# EAGLE design dac (EAGLE 9.3.0)
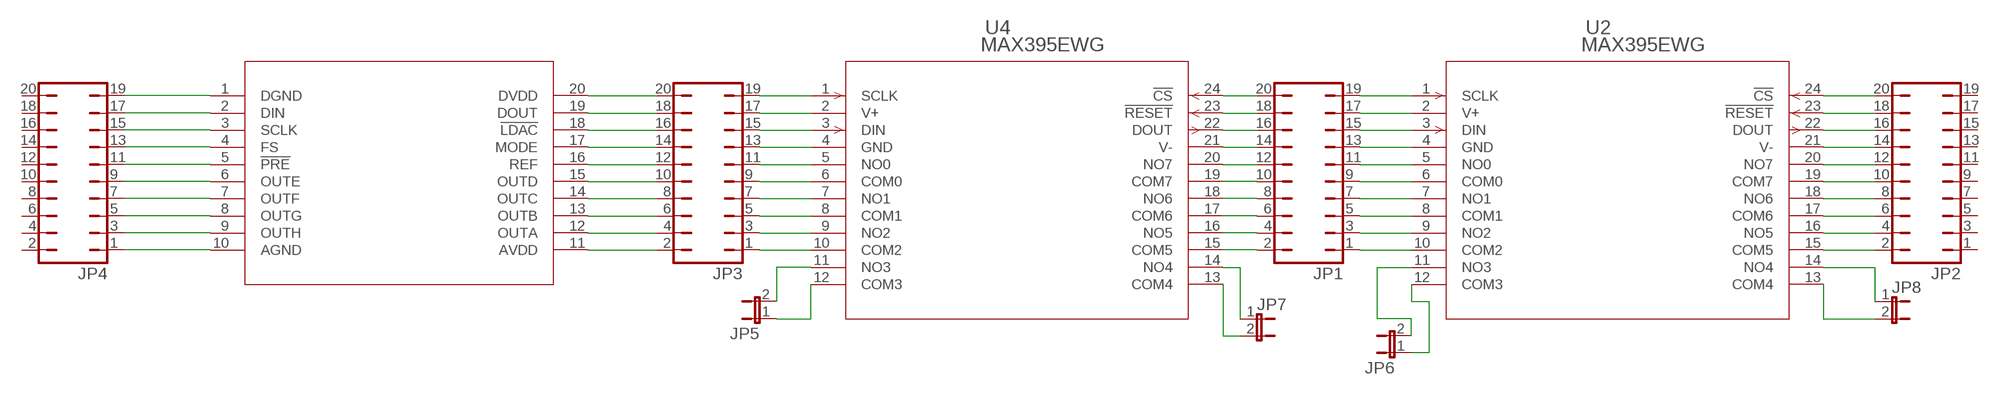
[diagram p0: schematic, sheet 1]

## Parts
JP1  JP10Q  [JP10Q]
JP2  JP10Q  [JP10Q]
JP3  JP10Q  [JP10Q]
JP4  JP10Q  [JP10Q]
JP5  JP1E  [JP1]
JP6  JP1E  [JP1]
JP7  JP1E  [JP1]
JP8  JP1E  [JP1]
U1  TLV5610_DW_20  [DW20]
U2  MAX395EWG  [21-0042B_24]
U4  MAX395EWG  [21-0042B_24]

## Nets
N$1: JP3.19 U4.1(SCLK)
N$2: JP3.17 U4.2(V+)
N$3: JP3.15 U4.3(DIN)
N$4: JP3.13 U4.4(GND)
N$5: JP3.11 U4.5(NO0)
N$6: JP3.9 U4.6(COM0)
N$7: JP3.7 U4.7(NO1)
N$8: JP3.5 U4.8(COM1)
N$9: JP3.3 U4.9(NO2)
N$10: JP3.1 U4.10(COM2)
N$11: JP1.20 U4.24(!CS)
N$12: JP1.18 U4.23(!RESET)
N$13: JP1.16 U4.22(DOUT)
N$14: JP1.14 U4.21(V-)
N$15: JP1.12 U4.20(NO7)
N$16: JP1.10 U4.19(COM7)
N$17: JP1.8 U4.18(NO6)
N$18: JP1.6 U4.17(COM6)
N$19: JP1.4 U4.16(NO5)
N$20: JP1.2 U4.15(COM5)
N$21: JP3.20 U1.20(DVDD)
N$22: JP3.18 U1.19(DOUT)
N$23: JP3.16 U1.18(!LDAC)
N$24: JP3.14 U1.17(MODE)
N$25: JP3.12 U1.16(REF)
N$26: JP3.10 U1.15(OUTD)
N$27: JP3.8 U1.14(OUTC)
N$28: JP3.6 U1.13(OUTB)
N$29: JP3.4 U1.12(OUTA)
N$30: JP3.2 U1.11(AVDD)
N$31: JP4.1 U1.10(AGND)
N$32: JP4.3 U1.9(OUTH)
N$33: JP4.5 U1.8(OUTG)
N$34: JP4.7 U1.7(OUTF)
N$35: JP4.9 U1.6(OUTE)
N$36: JP4.11 U1.5(!PRE)
N$37: JP4.13 U1.4(FS)
N$38: JP4.15 U1.3(SCLK)
N$39: JP4.17 U1.2(DIN)
N$40: JP4.19 U1.1(DGND)
N$41: JP1.19 U2.1(SCLK)
N$42: JP1.17 U2.2(V+)
N$43: JP1.15 U2.3(DIN)
N$44: JP1.13 U2.4(GND)
N$45: JP1.11 U2.5(NO0)
N$46: JP1.9 U2.6(COM0)
N$47: JP1.7 U2.7(NO1)
N$48: JP1.5 U2.8(COM1)
N$49: JP1.3 U2.9(NO2)
N$50: JP1.1 U2.10(COM2)
N$51: JP2.20 U2.24(!CS)
N$52: JP2.18 U2.23(!RESET)
N$53: JP2.16 U2.22(DOUT)
N$54: JP2.14 U2.21(V-)
N$55: JP2.12 U2.20(NO7)
N$56: JP2.10 U2.19(COM7)
N$57: JP2.8 U2.18(NO6)
N$58: JP2.6 U2.17(COM6)
N$59: JP2.4 U2.16(NO5)
N$60: JP2.2 U2.15(COM5)
N$61: JP5.2 U4.11(NO3)
N$62: JP5.1 U4.12(COM3)
N$63: JP7.1 U4.14(NO4)
N$64: JP7.2 U4.13(COM4)
N$65: JP6.2 U2.11(NO3)
N$66: JP6.1 U2.12(COM3)
N$67: JP8.1 U2.14(NO4)
N$68: JP8.2 U2.13(COM4)
Unconnected: JP2.1 JP2.3 JP2.5 JP2.7 JP2.9 JP2.11 JP2.13 JP2.15 JP2.17 JP2.19 JP4.2 JP4.4 JP4.6 JP4.8 JP4.10 JP4.12 JP4.14 JP4.16 JP4.18 JP4.20

## Library data of the parts
JP1-JP4 = jumper:JP10Q: JUMPER
JP5-JP8 = jumper:JP1E: JUMPER
U1 = tlv5610a:TLV5610_DW_20; MANUFACTURER_PART_NUMBER: TLV5610_DW_20; VENDOR: Texas Instruments
U2 U4 = max395:MAX395EWG; MANUFACTURER_PART_NUMBER: max395ewg; VENDOR: Maxim Integrated Products

## Net classes
1 power: width 0.254 mm

## Board
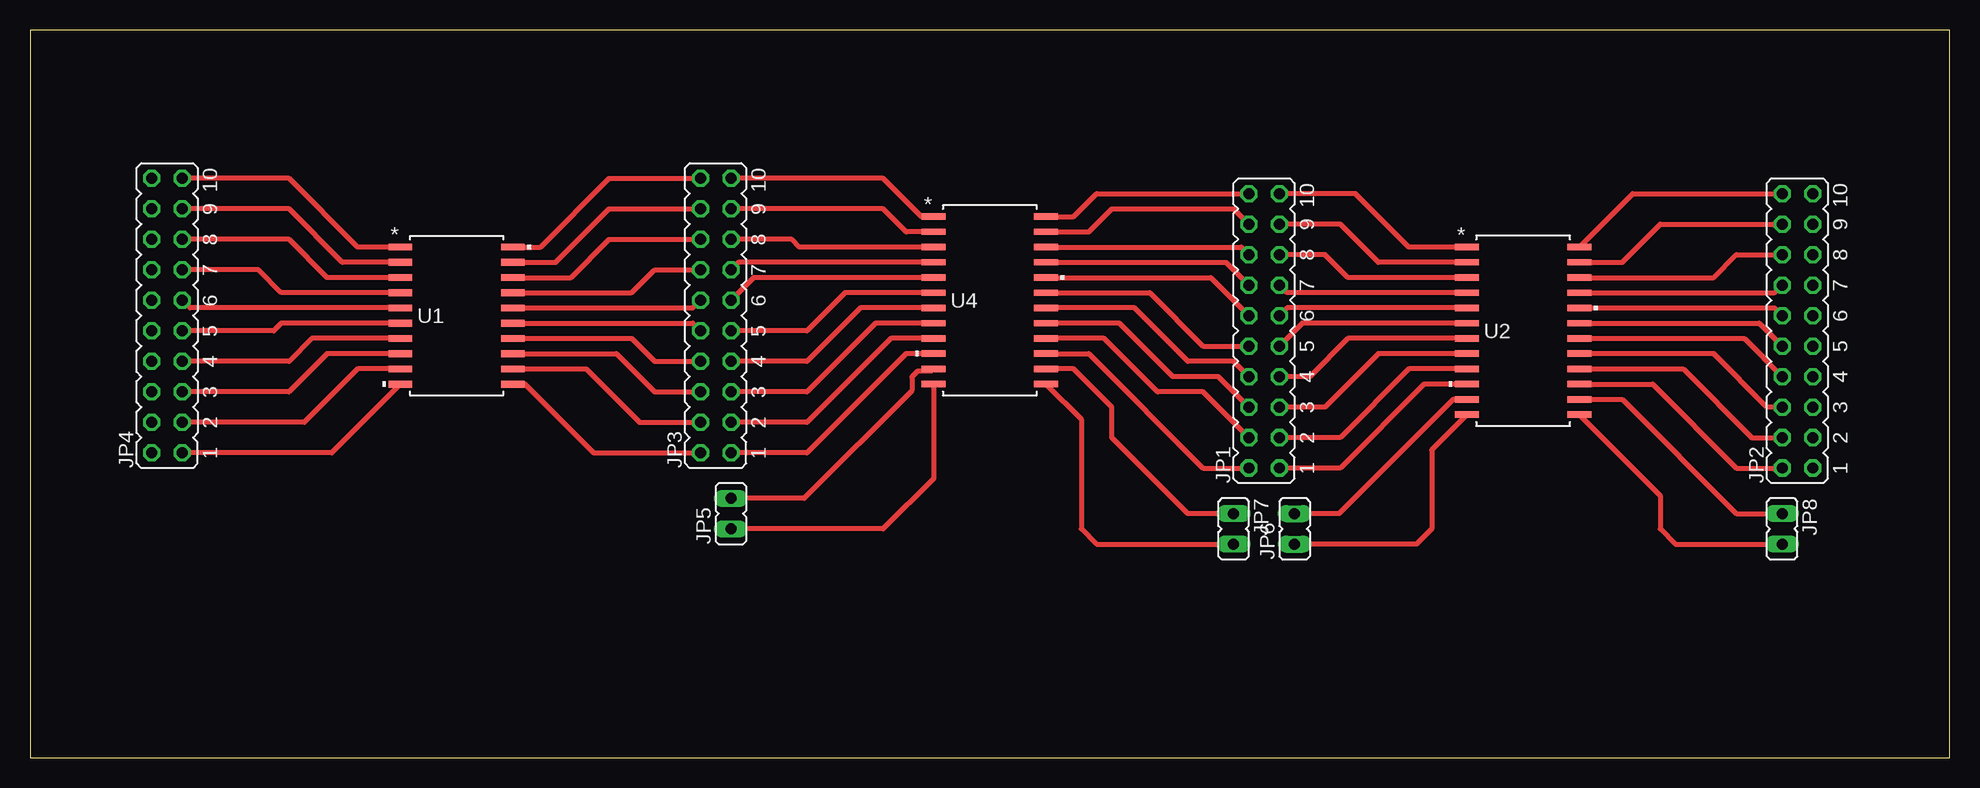
[diagram p1: board, top side]

Size 160 x 60.63 mm. Coordinates in mm from the lower left corner, seen from the top.
Outline: 0,0 160,0 160,60.63 0,60.63 0,0
Copper layers (1*16): Top 0.035mm / dielectric 1.5mm / Bottom 0.035mm
Design rules "default *": minimum track width 6mil, minimum drill 0.35mm, track to track 24mil, track to pad 24mil, pad to pad 24mil, via to via 24mil, smd to smd 24mil, copper to edge 40mil, drill to drill 6mil, minimum pad ring 10mil, minimum via ring 8mil, stop-mask expansion 4mil, vias tented up to drill 0mil, thermal gap 10mil

### Footprints (pad centres in the part's own frame; a part is rotated, then mirrored left to right if it is on the bottom)
JP10Q = drill 0.914 octagon: 1 -11.43,-1.27; 2 -11.43,1.27; 3 -8.89,-1.27; 4 -8.89,1.27; 5 -6.35,-1.27; 6 -6.35,1.27; 7 -3.81,-1.27; 8 -3.81,1.27; 9 -1.27,-1.27; 10 -1.27,1.27; 11 1.27,-1.27; 12 1.27,1.27; 13 3.81,-1.27; 14 3.81,1.27; 15 6.35,-1.27; 16 6.35,1.27; 17 8.89,-1.27; 18 8.89,1.27; 19 11.43,-1.27; 20 11.43,1.27
JP1 = drill 0.914 long: 1 0,-1.27; 2 0,1.27
DW20 = smd 1.981 x 0.559: 1 -4.686,5.715; 2 -4.686,4.445; 3 -4.686,3.175; 4 -4.686,1.905; 5 -4.686,0.635; 6 -4.686,-0.635; 7 -4.686,-1.905; 8 -4.686,-3.175; 9 -4.686,-4.445; 10 -4.686,-5.715; 11 4.686,-5.715; 12 4.686,-4.445; 13 4.686,-3.175; 14 4.686,-1.905; 15 4.686,-0.635; 16 4.686,0.635; 17 4.686,1.905; 18 4.686,3.175; 19 4.686,4.445; 20 4.686,5.715
21-0042B_24 = smd 1.981 x 0.533: 1 -4.686,6.985; 2 -4.686,5.715; 3 -4.686,4.445; 4 -4.686,3.175; 5 -4.686,1.905; 6 -4.686,0.635; 7 -4.686,-0.635; 8 -4.686,-1.905; 9 -4.686,-3.175; 10 -4.686,-4.445; 11 -4.686,-5.715; 12 -4.686,-6.985; 13 4.686,-6.985; 14 4.686,-5.715; 15 4.686,-4.445; 16 4.686,-3.175; 17 4.686,-1.905; 18 4.686,-0.635; 19 4.686,0.635; 20 4.686,1.905; 21 4.686,3.175; 22 4.686,4.445; 23 4.686,5.715; 24 4.686,6.985

### Placement (x,y rotation side)
JP1  102.87,35.56 90 top
JP2  147.32,35.56 90 top
JP3  57.15,36.83 90 top
JP4  11.43,36.83 90 top
JP5  58.42,20.32 0 top
JP6  105.41,19.05 0 top
JP7  100.33,19.05 180 top
JP8  146.05,19.05 180 top
U1  35.56,36.83 0 top
U2  124.46,35.56 0 top
U4  80.01,38.1 0 top

### Tracks (layer width: path | path; a pad name or v marks a point on that pad's centre or on a via)
N$1
  Top 0.406: U4.1 74.3,45.09 71.12,48.26 JP3.19
N$2
  Top 0.406: U4.2 73.03,43.81 71.12,45.72 JP3.17
N$3
  Top 0.406: U4.3 64.14,42.55 63.5,43.18 JP3.15
N$4
  Top 0.406: U4.4 59.05,41.27 JP3.13
N$5
  Top 0.406: U4.5 60.33,40.01 JP3.11
N$6
  Top 0.406: U4.6 67.94,38.73 64.77,35.56 JP3.9
N$7
  Top 0.406: U4.7 69.22,37.47 64.77,33.02 JP3.7
N$8
  Top 0.406: U4.8 70.48,36.2 64.77,30.48 JP3.5
N$9
  Top 0.406: U4.9 71.75,34.92 64.77,27.94 JP3.3
N$10
  Top 0.406: U4.10 73.03,33.66 64.77,25.4 JP3.1
N$11
  Top 0.406: U4.24 87,45.09 88.9,46.99 JP1.20
N$12
  Top 0.406: U4.23 88.27,43.81 90.17,45.72 100.33,45.72 JP1.18
N$13
  Top 0.406: U4.22 100.97,42.55 JP1.16
N$14
  Top 0.406: U4.21 99.69,41.27 JP1.14
N$15
  Top 0.406: U4.20 98.42,40.01 JP1.12
N$16
  Top 0.406: U4.19 93.34,38.73 97.79,34.29 JP1.10
N$17
  Top 0.406: JP1.8 100.33,33.02 96.52,33.02 92.08,37.47 U4.18
N$18
  Top 0.406: JP1.6 99.06,31.75 95.25,31.75 90.81,36.2 U4.17
N$19
  Top 0.406: JP1.4 97.79,30.48 93.98,30.48 89.53,34.92 U4.16
N$20
  Top 0.406: U4.15 88.27,33.66 97.79,24.13 JP1.2
N$21
  Top 0.406: U1.20 42.55,42.55 48.26,48.26 JP3.20
N$22
  Top 0.406: U1.19 43.81,41.27 48.26,45.72 JP3.18
N$23
  Top 0.406: U1.18 45.09,40.01 48.26,43.18 JP3.16
N$24
  Top 0.406: U1.17 50.16,38.73 52.07,40.64 JP3.14
N$25
  Top 0.406: U1.16 55.24,37.47 JP3.12
N$26
  Top 0.406: U1.15 55.24,36.2 JP3.10
N$27
  Top 0.406: U1.14 50.16,34.92 52.07,33.02 JP3.8
N$28
  Top 0.406: U1.13 48.9,33.66 52.07,30.48 JP3.6
N$29
  Top 0.406: U1.12 46.35,32.38 50.8,27.94 JP3.4
N$30
  Top 0.406: U1.11 41.27,31.11 46.99,25.4 JP3.2
N$31
  Top 0.406: U1.10 25.16,25.4 JP4.1
N$32
  Top 0.406: U1.9 27.3,32.38 22.86,27.94 JP4.3
N$33
  Top 0.406: U1.8 24.77,33.66 21.59,30.48 JP4.5
N$34
  Top 0.406: U1.7 23.5,34.92 21.59,33.02 JP4.7
N$35
  Top 0.406: U1.6 20.95,36.2 20.32,35.56 JP4.9
N$36
  Top 0.406: U1.5 13.34,37.47 JP4.11
N$37
  Top 0.406: U1.4 20.95,38.73 19.05,40.64 JP4.13
N$38
  Top 0.406: U1.3 24.77,40.01 21.59,43.18 JP4.15
N$39
  Top 0.406: U1.2 26.04,41.27 21.59,45.72 JP4.17
N$40
  Top 0.406: U1.1 27.3,42.55 21.59,48.26 JP4.19
N$41
  Top 0.406: U2.1 114.94,42.55 110.49,46.99 JP1.19
N$42
  Top 0.406: U2.2 112.39,41.27 109.22,44.45 JP1.17
N$43
  Top 0.406: U2.3 109.86,40.01 107.95,41.91 JP1.15
N$44
  Top 0.406: U2.4 104.78,38.73 JP1.13
N$45
  Top 0.406: U2.5 104.78,37.47 JP1.11
N$46
  Top 0.406: U2.6 106.05,36.2 JP1.9
N$47
  Top 0.406: U2.7 109.86,34.92 106.68,31.75 JP1.7
N$48
  Top 0.406: U2.8 112.39,33.66 107.95,29.21 JP1.5
N$49
  Top 0.406: U2.9 114.94,32.38 109.22,26.67 JP1.3
N$50
  Top 0.406: U2.10 116.2,31.11 109.22,24.13 JP1.1
N$51
  Top 0.406: U2.24 133.59,46.99 JP2.20
N$52
  Top 0.406: U2.23 132.72,41.27 135.89,44.45 JP2.18
N$53
  Top 0.406: U2.22 140.34,40.01 142.24,41.91 JP2.16
N$54
  Top 0.406: U2.21 145.41,38.73 JP2.14
N$55
  Top 0.406: U2.20 145.41,37.47 JP2.12
N$56
  Top 0.406: U2.19 144.15,36.2 JP2.10
N$57
  Top 0.406: U2.18 142.88,34.92 JP2.8
N$58
  Top 0.406: JP2.6 144.78,29.21 140.34,33.66 U2.17
N$59
  Top 0.406: U2.16 137.79,32.38 143.51,26.67 JP2.4
N$60
  Top 0.406: U2.15 135.25,31.11 142.24,24.13 JP2.2
N$61
  Top 0.406: U4.11 75.13,32.19 74,32.19 73.52,31.72 73.52,30.58 64.53,21.59 JP5.2
N$62
  Top 0.406: U4.12 75.32,23.25 71.12,19.05 JP5.1
N$63
  Top 0.406: JP7.1 96.52,20.32 90.17,26.67 90.17,29.21 87,32.38 U4.14
N$64
  Top 0.406: U4.13 87.63,28.18 87.63,19.05 88.9,17.78 JP7.2
N$65
  Top 0.406: U2.11 118.64,29.84 109.11,20.32 JP6.2
N$66
  Top 0.406: U2.12 116.84,25.64 116.84,19.05 115.57,17.78 JP6.1
N$67
  Top 0.406: U2.14 132.72,29.84 142.24,20.32 JP8.1
N$68
  Top 0.406: U2.13 135.89,21.83 135.89,19.05 137.16,17.78 JP8.2